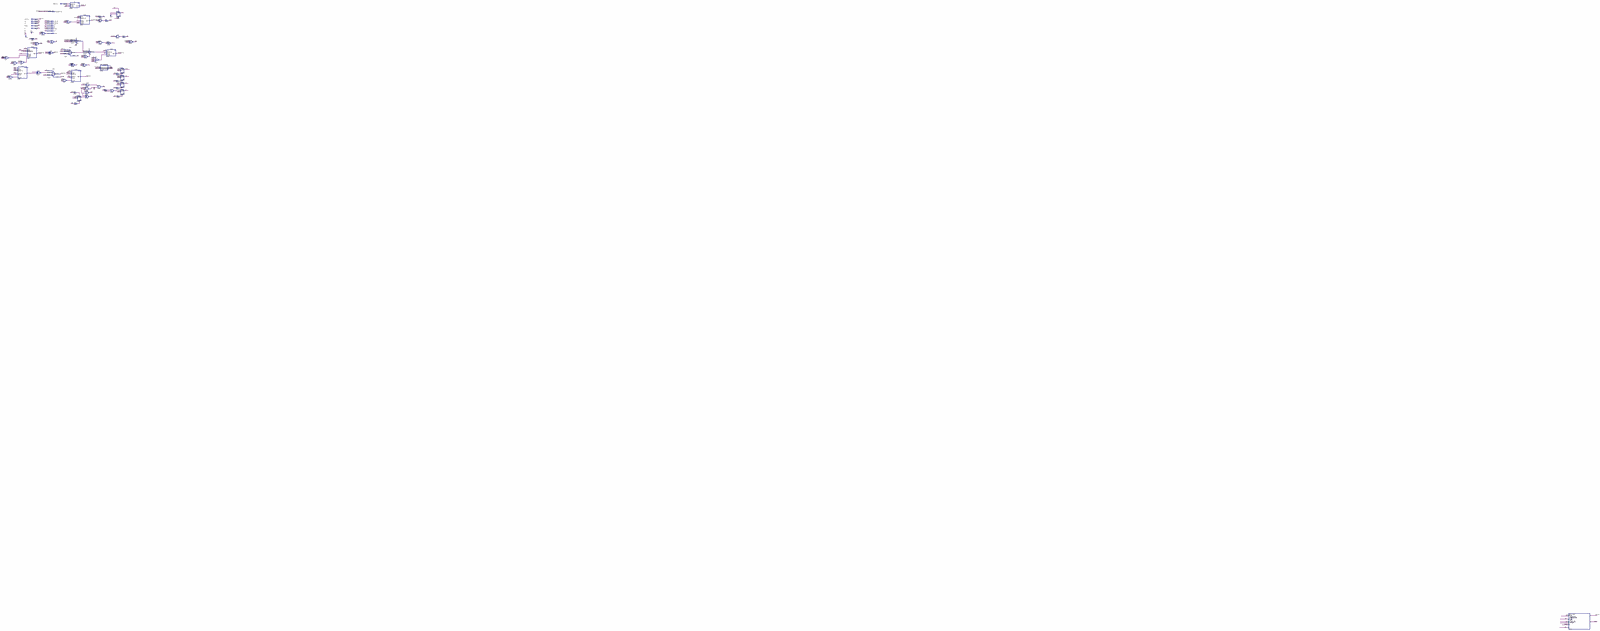
[diagram p0: schematic sheet, whole]
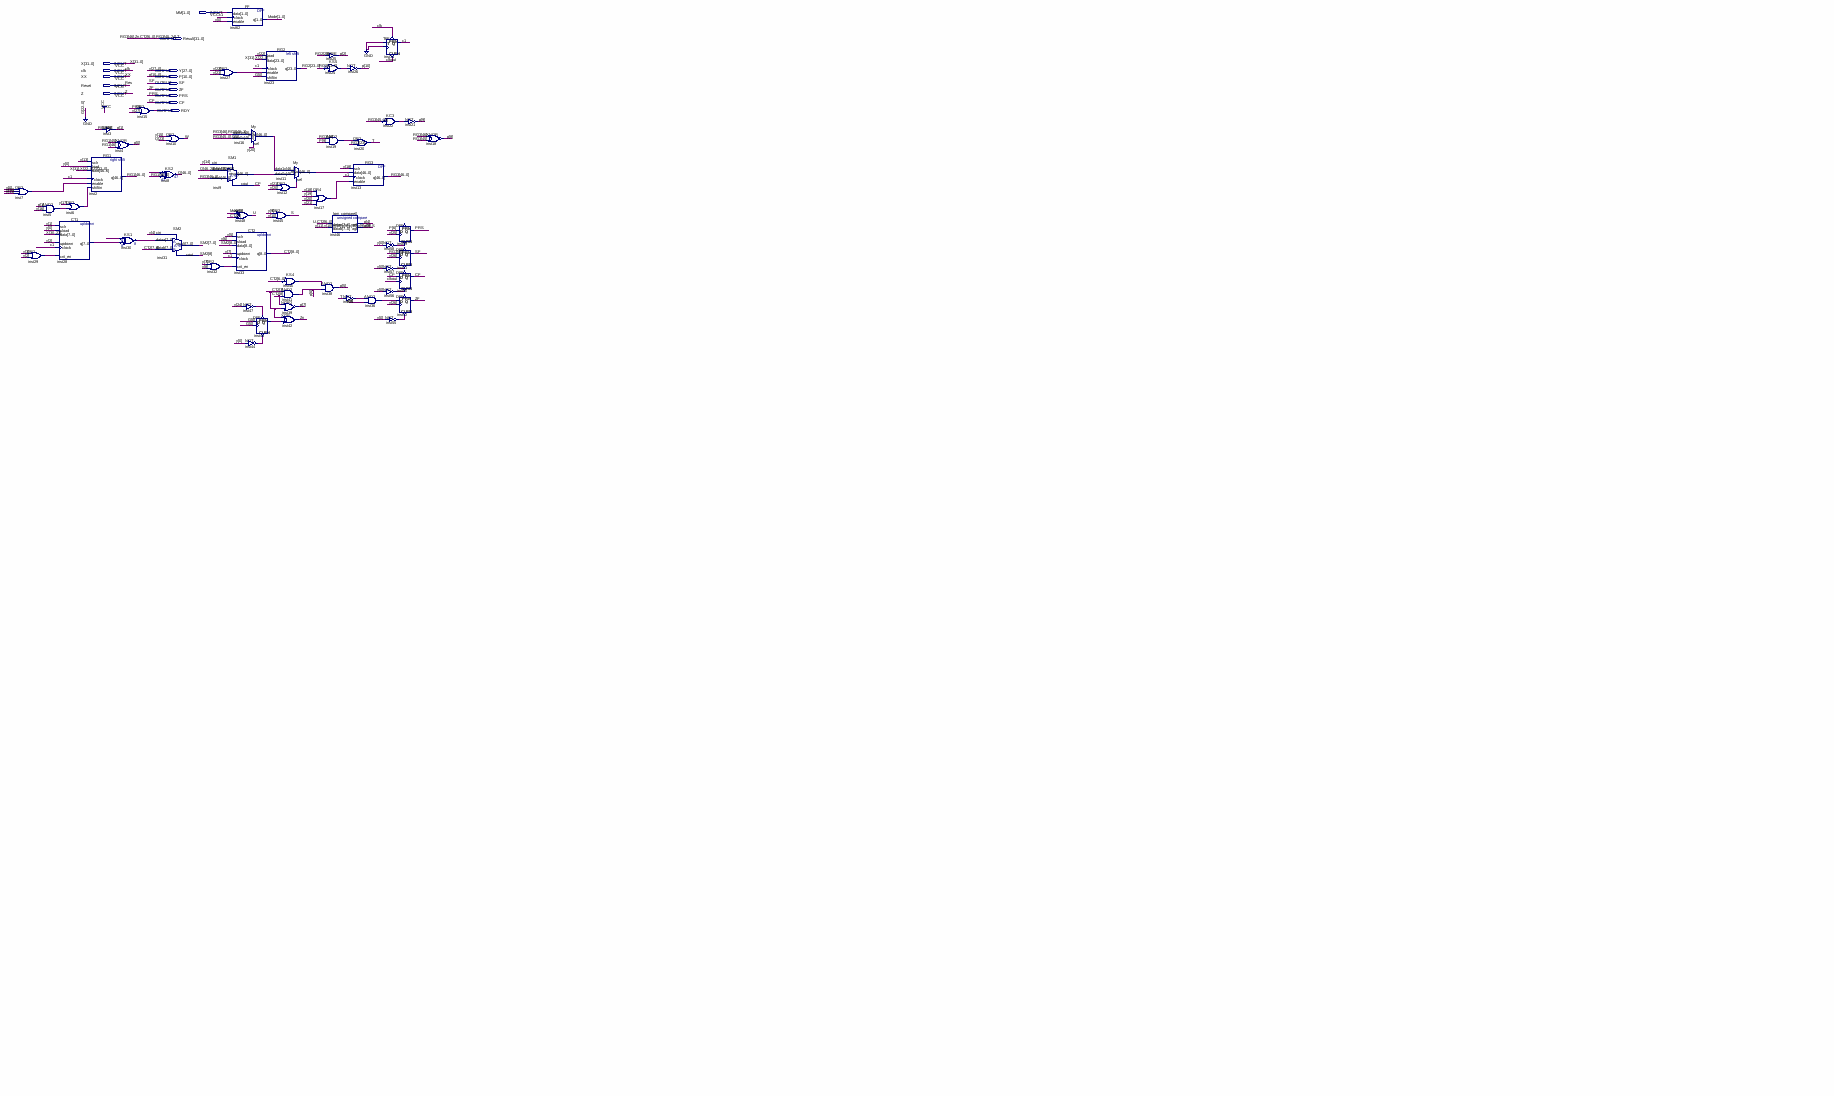
[diagram p1: schematic sheet, upper left part]
// Quartus schematic Ob.bdf as structural Verilog: 55 symbols, 14 pins
module Ob (
  input  [1:0] MM,
  input  [31:0] X,
  input  clk,
  input  XX,
  input  Reset,
  input  Z,
  output [31:0] Result,
  output [27:0] Y,
  output [10:0] P,
  output SF,
  output ZF,
  output PRS,
  output CF,
  output RDY
);

  wire c1, clkout, CP, inst5_out, inst6_out, inst7_out, inst12_out, inst17_out, inst19_out, inst22_result,
       inst24_result, inst27_out, inst29_out, inst32_out, inst35_out, inst36_out, inst40_result, inst43_q,
       inst44_out, inst47_out, inst55_out, inst56_out, inst57_out, inst58_out, S, U, W;
  wire [1:0] Mode;
  wire [7:0] inst28_q, inst30_result;
  wire [8:0] SM2;
  wire [8:7] CT2;
  wire [23:0] RG2, RG3;
  wire [46:0] inst9_result, inst11_result, inst16_result, Q, RG1;

  or inst7 (inst7_out, Y[0], Y[12], Y[13]);
  or inst29 (inst29_out, Y[3], Y[2]);
  and inst5 (inst5_out, P[1], Y[16]);
  or inst6 (inst6_out, Y[17], inst5_out);
  CT1 inst28 (.sclr(Y[1]), .sload(Y[0]), .data(X[30:23]), .updown(Y[2]), .clock(c1), .cnt_en(inst29_out), .q(inst28_q));
  assign P[1] = RG1[46];  // WIRE inst3
  RG1 inst2 (
    .sclr(Y[13]), .load(Y[0]), .data({X[31], X[22:0], {23{1'b0}}}), .clock(c1), .enable(inst7_out),
    .shiftin(inst6_out), .q(RG1));
  xnor inst4 (P[0], RG1[45], RG1[46]);
  KS1 inst30 (.data0x({8{Y[4]}}), .data1x(inst28_q), .result(inst30_result));
  or inst15 (RDY, PRS, Y[27]);
  or inst10 (W, Y[15], Q[23]);
  KS2 inst8 (.data0x({47{Y[14]}}), .data1x(RG1), .result(Q));
  SM2 inst31 (.dataa(inst30_result), .datab({CT2[7], Result[29:23]}), .cin(Y[4]), .result(SM2[7:0]), .cout(SM2[8]));
  or inst27 (inst27_out, Y[22], Y[23]);
  SM1 inst9 (
    .dataa({Q[46:23], W, Q[21:0]}), .datab({Result[31], Result[22:1], RG3}), .cin(Y[14]),
    .result(inst9_result), .cout(CP));
  or inst32 (inst32_out, Y[7], Y[8]);
  FF inst62 (.data(MM), .clock(c1), .enable(Y[0]), .q(Mode));
  My inst16 (
    .data1x({{2{Result[31]}}, Result[22:1], RG3[23:1]}), .data0x({Result[22:1], RG3, 1'b0}), .sel(Y[20]),
    .result(inst16_result));
  xor inst48 (U, Mode[1], CT2[7]);
  CT2 inst33 (
    .sclr(Y[5]), .sload(Y[6]), .data(SM2), .updown(Y[7]), .clock(c1), .cnt_en(inst32_out),
    .q({CT2, Result[29:23]}));
  not inst47 (inst47_out, Y[24]);
  DFF inst43 (.CLRN(inst44_out), .CLK(1'b0), .D(1'b0), .PRN(inst47_out), .Q(inst43_q));
  not inst44 (inst44_out, Y[0]);
  RG2 inst23 (.load(Y[22]), .data({X[31], X[22:0]}), .clock(c1), .enable(inst27_out), .shiftin(1'b0), .q(RG2));
  or inst45 (S, Y[9], Y[10]);
  My inst11 (.data1x(inst16_result), .data0x(inst9_result), .sel(inst12_out), .result(inst11_result));
  or inst12 (inst12_out, Y[21], Y[20]);
  KS4 inst40 (.data(Result[29:23]), .result(inst40_result));
  and inst41 (P[6], CT2[7], CT2[8]);
  nor inst39 (P[7], CT2[8], CT2[7]);
  xor inst42 (Result[30], CT2[7], inst43_q);
  KS5 inst24 (.data(RG2), .result(inst24_result));
  or inst17 (inst17_out, Y[18], Y[19], Y[20], Y[21]);
  and inst38 (P[5], inst40_result, P[6]);
  assign P[2] = RG2[23];  // WIRE inst25
  and inst19 (inst19_out, Result[31], P[9]);
  lpm_compare0 inst46 (
    .dataa({U, Result[29:23]}), .datab({Y[11:10], Y[10:9], Y[10:9], Y[9], S}), .aeb(P[4]), .agb(P[3]));
  not inst26 (P[10], inst24_result);
  or inst20 (Result[0], inst19_out, RG3[23]);
  RG3 inst13 (.sclr(Y[18]), .data(inst11_result), .clock(c1), .enable(inst17_out), .q({Result[31], Result[22:1], RG3}));
  not inst35 (inst35_out, Result[0]);
  and inst36 (inst36_out, inst35_out, P[9]);
  TFF inst34 (.PRN(clk), .CLRN(clkout), .T(1'b0), .CLK(1'b0), .Q(c1));
  KC3 inst22 (.data({Result[22:1], RG3[23]}), .result(inst22_result));
  not inst58 (inst58_out, Y[0]);
  not inst57 (inst57_out, Y[0]);
  not inst56 (inst56_out, Y[0]);
  not inst55 (inst55_out, Y[0]);
  not inst21 (P[9], inst22_result);
  DFF inst49 (.CLRN(inst58_out), .CLK(Y[25]), .D(P[6]), .Q(PRS));  // open: PRN
  DFF inst51 (.CLRN(inst57_out), .CLK(Y[26]), .D(Result[31]), .Q(SF));  // open: PRN
  DFF inst50 (.CLRN(inst56_out), .CLK(clkout), .D(CP), .Q(CF));  // open: PRN
  DFF inst52 (.CLRN(inst55_out), .CLK(Y[26]), .D(inst36_out), .Q(ZF));  // open: PRN
  xnor inst18 (P[8], Result[31], Result[22]);
  block_name inst14 (.clk(clk), .p(P), .Mode(Mode), .XX(XX), .res(Reset), .Z(Z), .y(Y), .clkout(clkout));

  // Other names for the same wires on the sheet: CT2[6:0] = Result[29:23]; Res = Reset;
  //   RG3[46:24] = {Result[31], Result[22:1]}; T = Result[0]; Zn = Result[30]
endmodule
